# Altium schematic sheet PowerHalfBridge.SchDoc
size A3
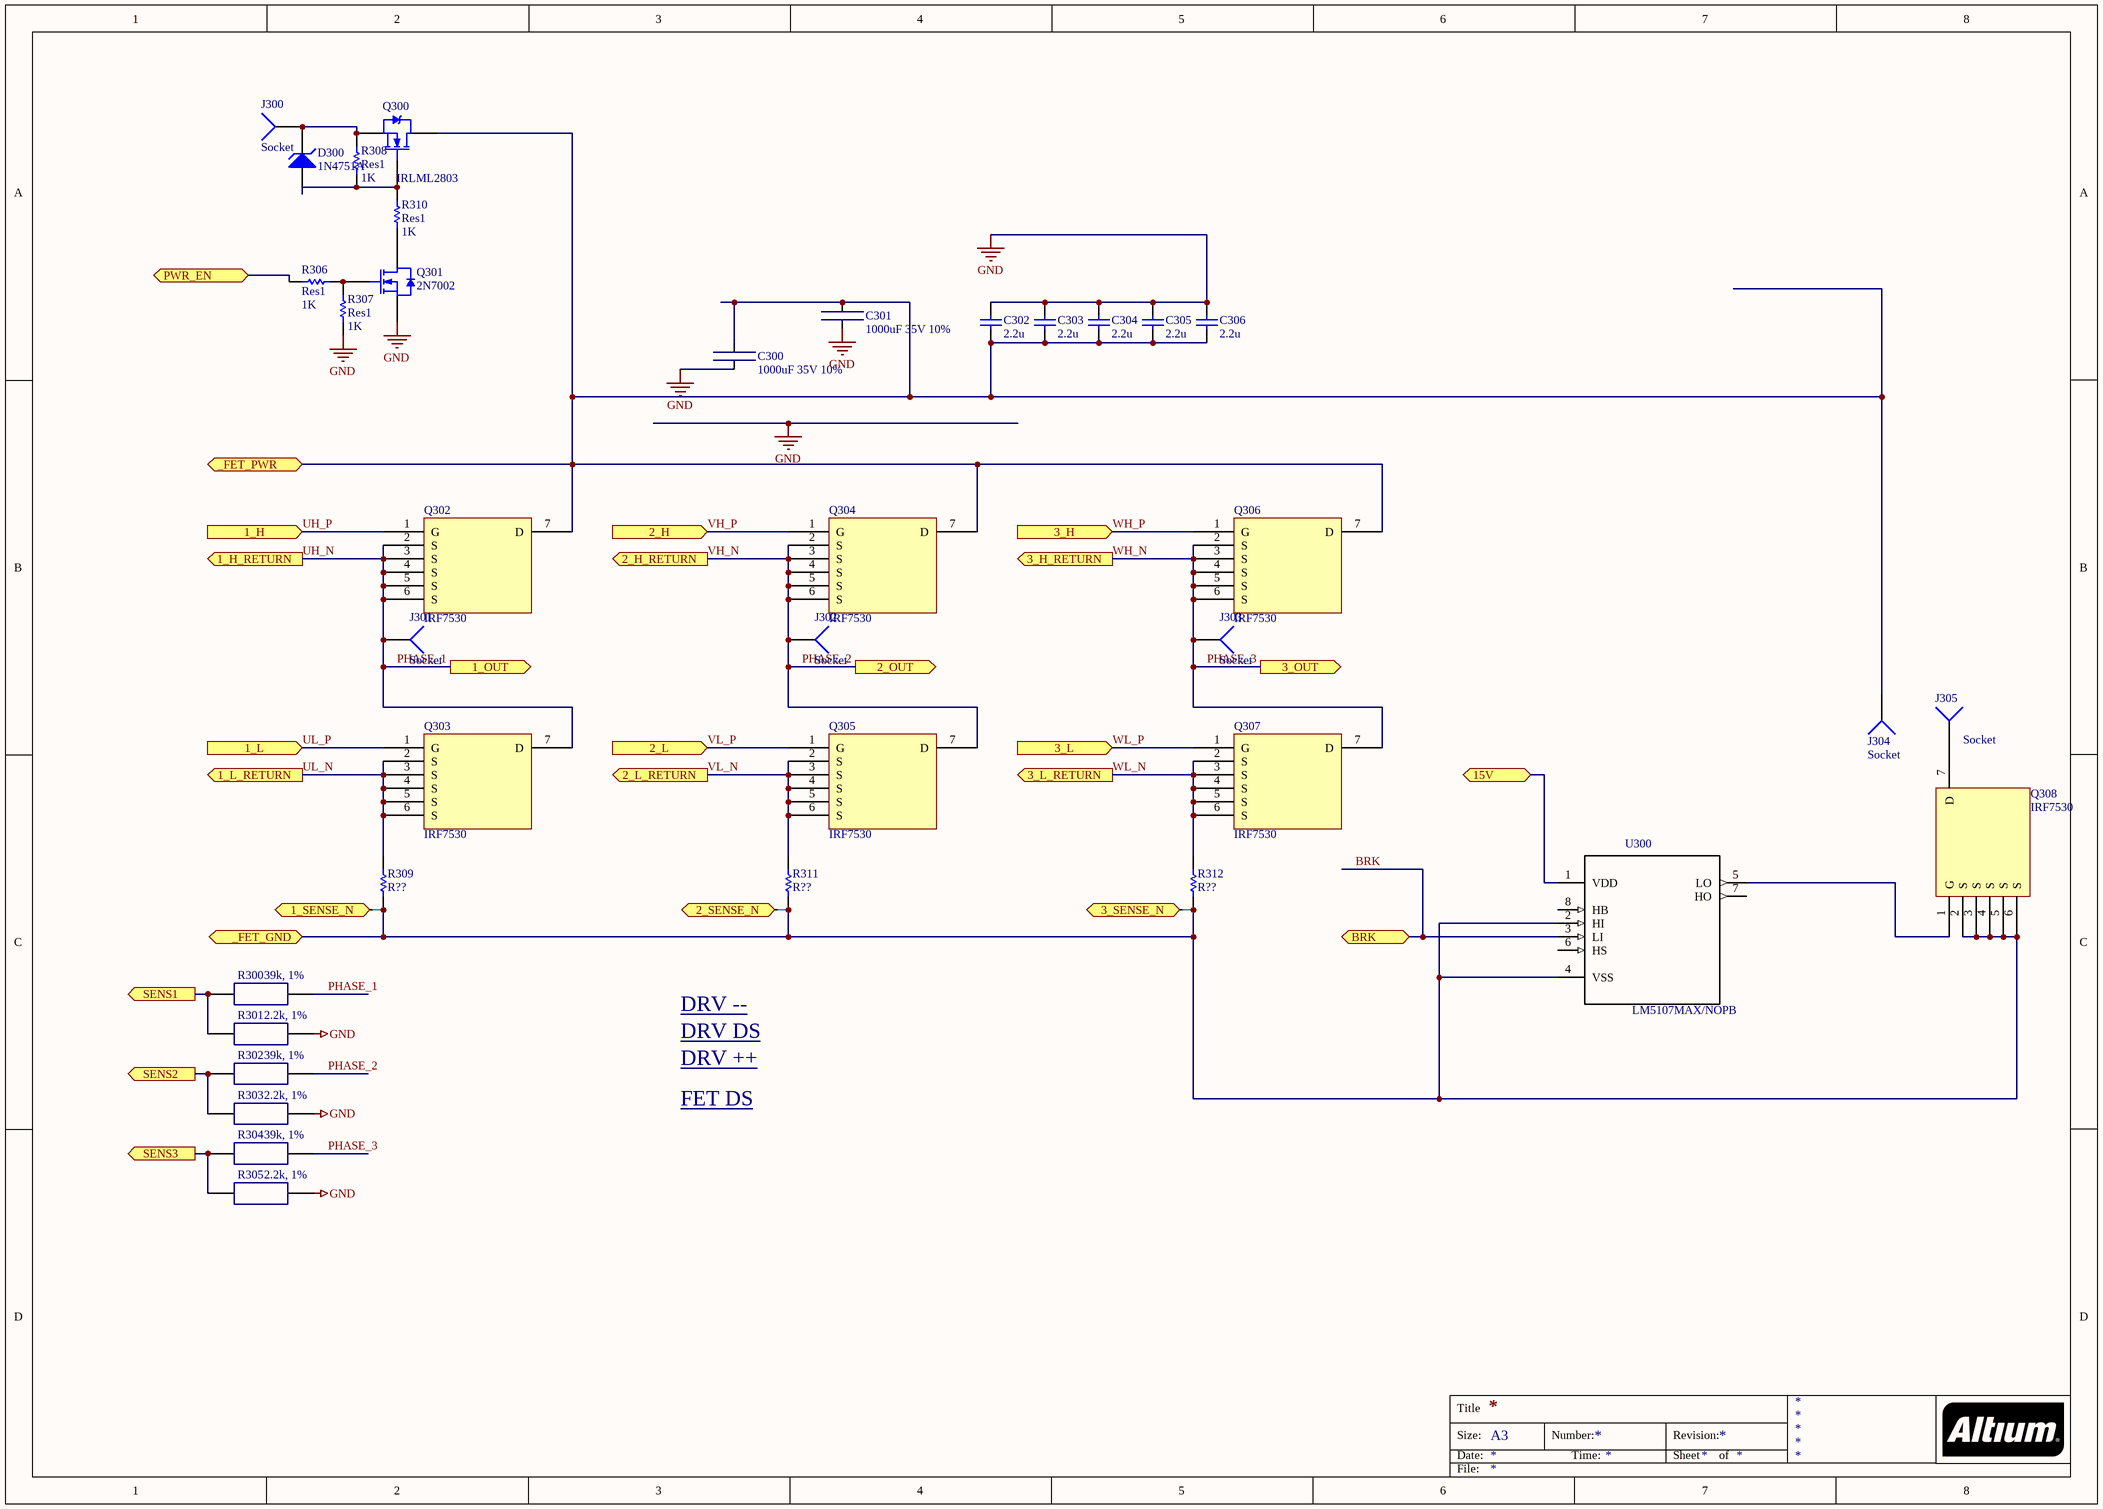
[diagram p0: PowerHalfBridge.SchDoc]

## Parts
C300  1000uF 35V 10%  [CAP_1mF_63V_SMD]
C301  1000uF 35V 10%  [CAP_1mF_63V_SMD]
C302  2.2u  [1210]
C303  2.2u  [1210]
C304  2.2u  [1210]
C305  2.2u  [1210]
C306  2.2u  [1210]
D300  1N4751A  [SOD80C]
J300  Socket  [PIN1]
J301  Socket  [PIN1]
J302  Socket  [PIN1]
J303  Socket  [PIN1]
J304  Socket  [PIN1]
J305  Socket  [PIN1]
NT300  NET_TIE  [NET_TIE_20mil]  (value not drawn)  (net tie, no BOM)
NT301  NET_TIE  [NET_TIE_20mil]  (value not drawn)  (net tie, no BOM)
NT302  NET_TIE  [NET_TIE_20mil]  (value not drawn)  (net tie, no BOM)
Q300  IRLML2803  [SOT-23]
Q301  2N7002  [SOT-23]
Q302  IRF7530  [D2PAK-7]
Q303  IRF7530  [D2PAK-7]
Q304  IRF7530  [D2PAK-7]
Q305  IRF7530  [D2PAK-7]
Q306  IRF7530  [D2PAK-7]
Q307  IRF7530  [D2PAK-7]
Q308  IRF7530  [D2PAK-7]
R300  39k, 1%  [0805x]
R301  2.2k, 1%  [0805x]
R302  39k, 1%  [0805x]
R303  2.2k, 1%  [0805x]
R304  39k, 1%  [0805x]
R305  2.2k, 1%  [0805x]
R306  Res1  value 1K  [0603x]
R307  Res1  value 1K  [0603x]
R308  Res1  value 1K  [0603x]
R309  value R??  [2512]  (hidden comment: Res1)
R310  Res1  value 1K  [0603x]
R311  value R??  [2512]  (hidden comment: Res1)
R312  value R??  [2512]  (hidden comment: Res1)
U300  LM5107MAX/NOPB  [SOIC127P620X175-8N]

## Ports
1_H (in), 1_H_RETURN (out), 1_L (in), 1_L_RETURN (out), 1_OUT (out), 1_SENSE_N (out), 2_H (in), 2_H_RETURN (out), 2_L (in), 2_L_RETURN (out), 2_OUT (out), 2_SENSE_N (out), 3_H (in), 3_H_RETURN (out), 3_L (in), 3_L_RETURN (out), 3_OUT (out), 3_SENSE_N (out), 15V, _FET_GND, _FET_PWR, BRK, PWR_EN, SENS1 (out), SENS2 (out), SENS3 (out)

## Nets
GND: C300.2 C301.1 C302.2 C303.2 C304.2 C305.2 C306.2 Q301.2(S) R301.2 R303.2 R305.2 R307.2
1_SENSE_N: NT300.1 ; port 1_SENSE_N
2_SENSE_N: NT301.1 ; port 2_SENSE_N
3_SENSE_N: NT302.1 ; port 3_SENSE_N
15V: U300.1(VDD) ; port 15V
_FET_GND: NT300.2 NT301.2 NT302.2 Q308.2(S) Q308.3(S) Q308.4(S) Q308.5(S) Q308.6(S) R309.1 R311.1 R312.1 U300.2(HI) U300.4(VSS) ; port _FET_GND
_FET_PWR: C300.1 C301.2 C302.1 C303.1 C304.1 C305.1 C306.1 J304.1 Q300.3(D) Q302.7(D) Q304.7(D) Q306.7(D) ; port _FET_PWR
BRK: U300.3(LI) ; port BRK
PHASE_1: J301.1 Q302.2(S) Q302.3(S) Q302.4(S) Q302.5(S) Q302.6(S) Q303.7(D) R300.2 ; port 1_H_RETURN, port 1_OUT  [also labelled UH_N]
PHASE_2: J302.1 Q304.2(S) Q304.3(S) Q304.4(S) Q304.5(S) Q304.6(S) Q305.7(D) R302.2 ; port 2_H_RETURN, port 2_OUT  [also labelled VH_N]
PHASE_3: J303.1 Q306.2(S) Q306.3(S) Q306.4(S) Q306.5(S) Q306.6(S) Q307.7(D) R304.2 ; port 3_H_RETURN, port 3_OUT  [also labelled WH_N]
PWR_EN: R306.2 ; port PWR_EN
SENS1: R300.1 R301.1 ; port SENS1
SENS2: R302.1 R303.1 ; port SENS2
SENS3: R304.1 R305.1 ; port SENS3
UH_P: Q302.1(G) ; port 1_H
UL_N: Q303.2(S) Q303.3(S) Q303.4(S) Q303.5(S) Q303.6(S) R309.2 ; port 1_L_RETURN
UL_P: Q303.1(G) ; port 1_L
VH_P: Q304.1(G) ; port 2_H
VL_N: Q305.2(S) Q305.3(S) Q305.4(S) Q305.5(S) Q305.6(S) R311.2 ; port 2_L_RETURN
VL_P: Q305.1(G) ; port 2_L
WH_P: Q306.1(G) ; port 3_H
WL_N: Q307.2(S) Q307.3(S) Q307.4(S) Q307.5(S) Q307.6(S) R312.2 ; port 3_L_RETURN
WL_P: Q307.1(G) ; port 3_L
NetD300_1: D300.1(A) Q300.1(G) R308.1 R310.2
NetD300_2: D300.2(K) J300.1 Q300.2(S) R308.2
NetJ305_1: J305.1 Q308.7(D)
NetQ301_1: Q301.1(G) R306.1 R307.1
NetQ301_3: Q301.3(D) R310.1
NetQ308_1: Q308.1(G) U300.5(LO)

Not connected (* = marked no-connect by the designer): U300 6(HS) 7(HO) 8(HB)

## Notes on the sheet
- DRV DS <http://www.ti.com/lit/ds/symlink/drv8323r.pdf>
- DRV -- <http://www.ti.com/product/drv8323r>
- DRV ++ <http://www.ti.com/tool/tida-00774>
- FET DS <https://www.infineon.com/dgdl/Infineon-IPB039N10N3G-DS-v02_03-en.pdf?fileId=db3a30431ce5fb52011d1ed1fd3915e0>
- Title
- Size:
- Date:
- A3
- Number:
- Time:
- Revision:
- Sheet
- of
- File:

## Library data of the parts
C300 C301 = Ceramic Chip Capacitor: Value: CAP CER 0.022UF 50V X7R 0402; Order Number: GRM155R71H223KA12D; Distributor: Murata Electronics; Package: 0402
C302-C306 = Cap: Capacitor; Value: 100pF; Published: 8-Jun-2000; LatestRevisionDate: 17-Jul-2002; LatestRevisionNote: Re-released for DXP Platform.; PackageReference: RAD-0.3; Publisher: Altium Limited; PackageDescription: Radial Cap, Thru-Hole; 2 Leads; 0.3 in Pin Spacing
D300 = 1N4751A: 1W Zener Diode; Published: 8-Jun-2000; LatestRevisionDate: 17-Jul-2002; LatestRevisionNote: Re-released for DXP Platform.; DatasheetDocument: REV. H; PackageReference: DO-41; Publisher: Altium Limited; Code_JEDEC: DO-204-AL; ComponentLink1Description: Manufacturer Link; ComponentLink1URL: http://www.vishay.com/; ComponentLink2Description: Datasheet; ComponentLink2URL: http://www.vishay.com/docs/85816/85816.pdf
NT300-NT302 = Net tie
Q300 = IRLML2803: HEXFET Power MOSFET; Published: 8-Jun-2000; LatestRevisionDate: 20-Nov-2009; LatestRevisionNote: IPC-7351 Footprint Added.; DatasheetVersion: Aug-1997; PackageReference: SOT-23; Publisher: Altium Limited; PackageDescription: 3-Pin SOT-23 Package 0.95 mm Pitch, 2.3 mm Lead Span; ComponentLink1Description: Manufacturer Link; ComponentLink1URL: http://www.irf.com/; ComponentLink2Description: Datasheet; ComponentLink2URL: http://www.irf.com/product-info/datasheets/data/irlml2803.pdf
Q301 = 2N7002: N-channel Enhancement Mode Field-effect Transistor; Published: 17-Sep-2003; LatestRevisionDate: 12-Dec-2006; LatestRevisionNote: IPC-7351 Footprint Added.; DatasheetVersion: 27-Jul-2000; PackageVersion: May-1999; PackageReference: SOT23; Publisher: Altium Limited; PackageDescription: 3-Pin SOT-23 Package 0.95 mm Pitch, 2.3 mm Lead Span; ComponentLink1Description: Manufacturer Link; ComponentLink1URL: http://www.semiconductors.philips.com/; ComponentLink2Description: Datasheet; ComponentLink2URL: http://www.semiconductors.philips.com/acrobat/datasheets/2N7002_4.pdf
R300 R302 R304 = SMD: Order Number: ERJ-3EKF3902V; Value: 39k, 1%; Package: RESC1608X05N(0603); Distributor: Panasonic
R301 R303 R305 = SMD: Order Number: ERJ-3EKF2201V; Value: 2.2k, 1%; Package: RESC1608X05N(0603); Distributor: Panasonic
R306-R312 = Res1: Resistor; Published: 8-Jun-2000; LatestRevisionDate: 17-Jul-2002; LatestRevisionNote: Re-released for DXP Platform.; PackageReference: AXIAL-0.3; Publisher: Altium Limited; PackageDescription: Axial Device, Thru-Hole; 2 Leads; 0.3 in Pin Spacing
U300 = LM5107MAX/NOPB: IC DVR HALF-BRIDGE HV 8-SOIC; MF: Texas Instruments; Availability: Good; Package: SOIC-8 Texas Instruments; MP: LM5107MAX/NOPB; Price: 1.38 USD; Value: *
J300-J305 = Socket: LatestRevisionDate: 17-Jul-2002; LatestRevisionNote: Re-released for DXP Platform.; Publisher: Altium Limited